# EAGLE design LB_BIT_w2_BRANCH-v02(rev1) (EAGLE 6.6.0)
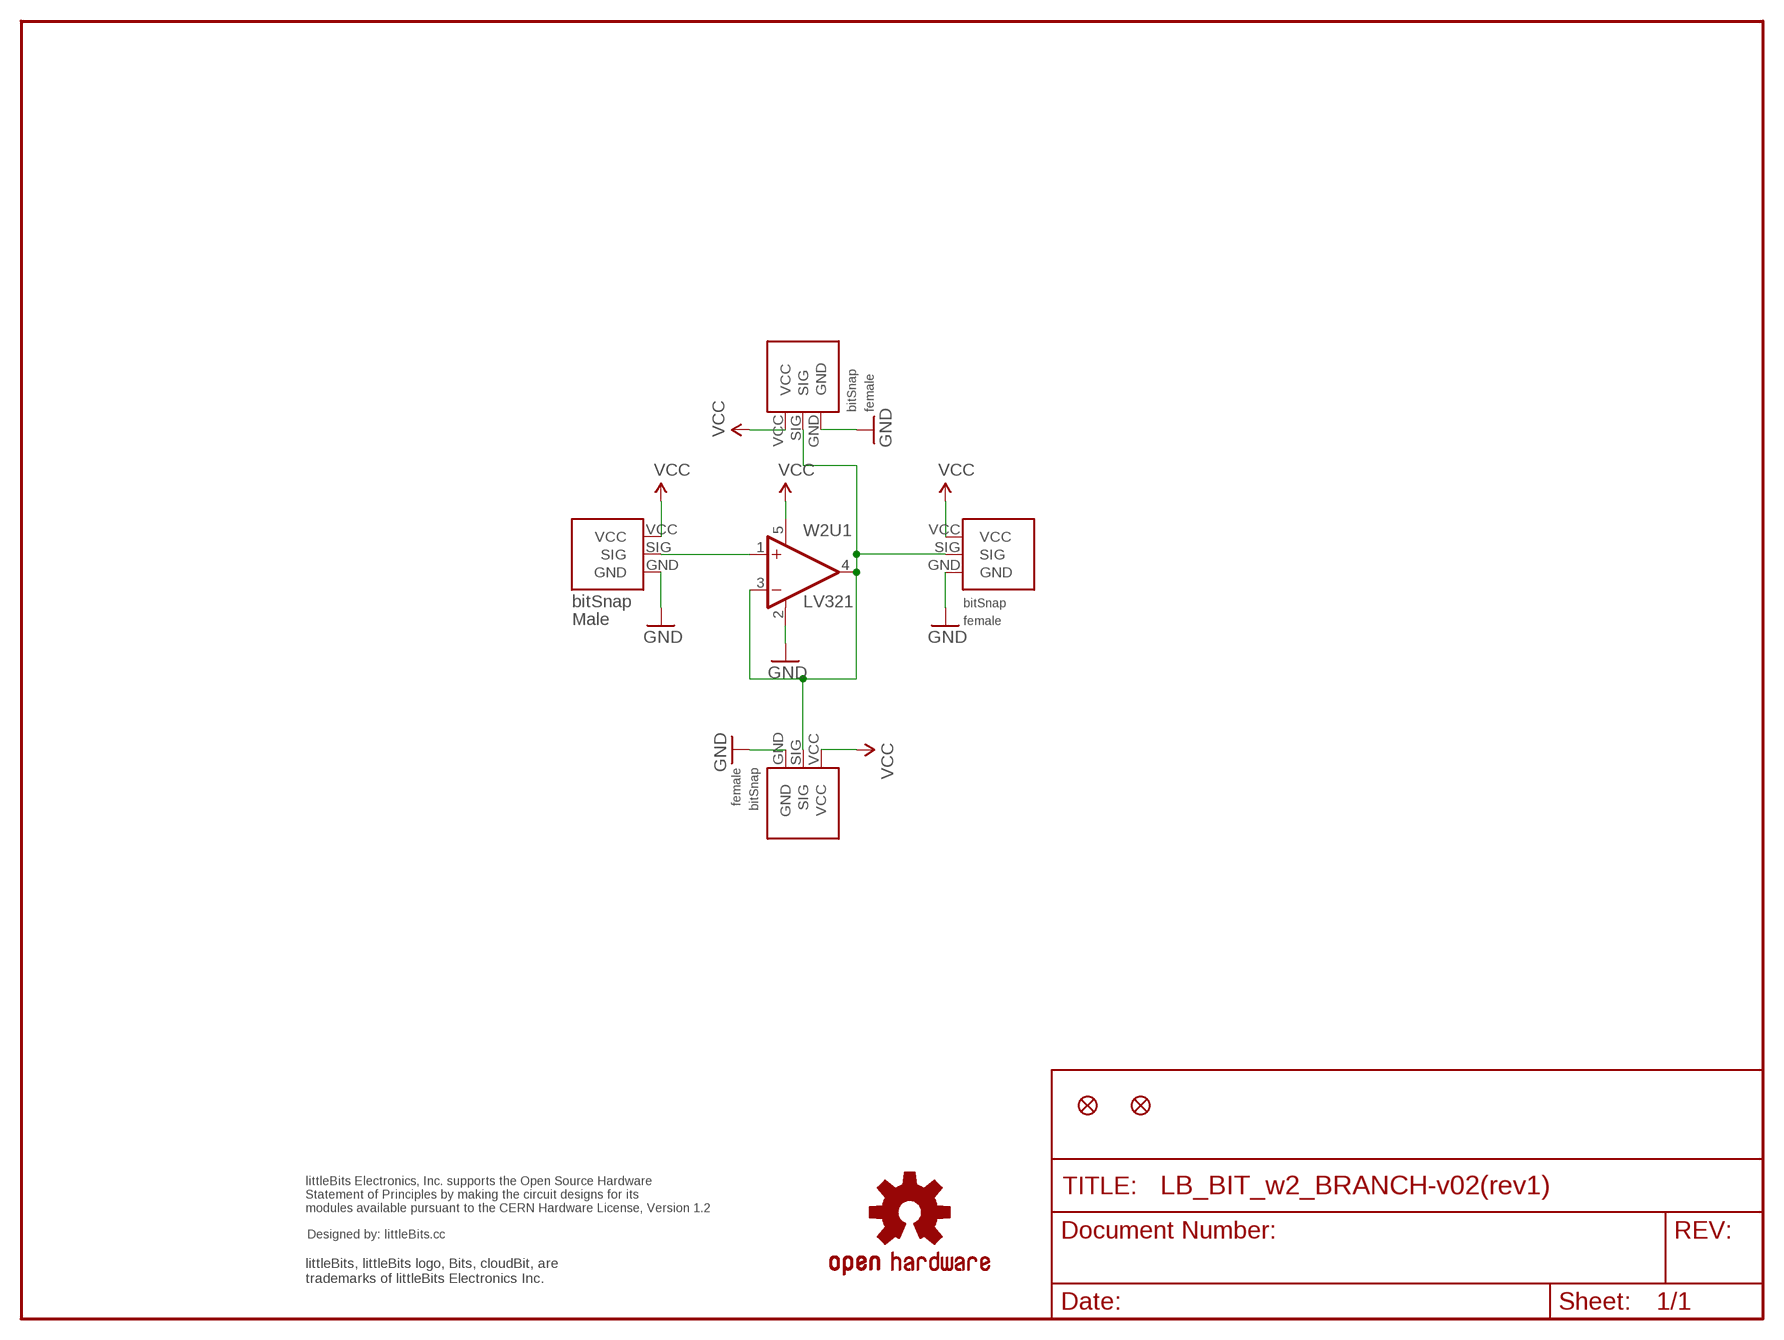
[diagram p0: schematic, sheet 1]

## Parts
JP1  FIDUCIAL1X2  [FIDUCIAL-1X2]
JP2  FIDUCIAL1X2  [FIDUCIAL-1X2]
U$1  OSHWCREDIT  [OSHWCREDIT]
U$6  OSHW-LOGOL  [OSHW-LOGO-L]
W2BSF1  BITSNAP_FEMALE  [BITSNAP_FEMALE]
W2BSF2  BITSNAP_FEMALE  [BITSNAP_FEMALE]
W2BSF3  BITSNAP_FEMALE  [BITSNAP_FEMALE]
W2BSM1  BITSNAP_MALE  [BITSNAP_MALE]
W2U1  LV321  [SC70-5]

## Nets
GND: W2BSF1.GND W2BSF2.GND W2BSF3.GND W2BSM1.GND W2U1.2(V-)
N$1: W2BSM1.SIG W2U1.1(+IN)
N$2: W2BSF1.SIG W2BSF2.SIG W2BSF3.SIG W2U1.3(-IN) W2U1.4(OUT)
VCC: W2BSF1.VCC W2BSF2.VCC W2BSF3.VCC W2BSM1.VCC W2U1.5(V+)

## Library data of the parts
JP1 JP2 = SparkFun:FIDUCIAL: Fiducial Alignment Points Various fiducial points for machine vision alignment.
U$1 = LITTLEBITS:OSHWCREDIT
U$6 = SparkFun_NEW:OSHW-LOGO: Open Source Hardware Logo This logo indicates the piece of hardware it is found on incorporates a OSHW license and/or adheres to the definition of open source hardware found here: http://freedomdefined.org/OSHW
W2BSF1-W2BSF3 = bitSnap:BITSNAP_FEMALE
W2BSM1 = bitSnap:BITSNAP_MALE
W2U1 = LITTLEBITS:LV321

## Board
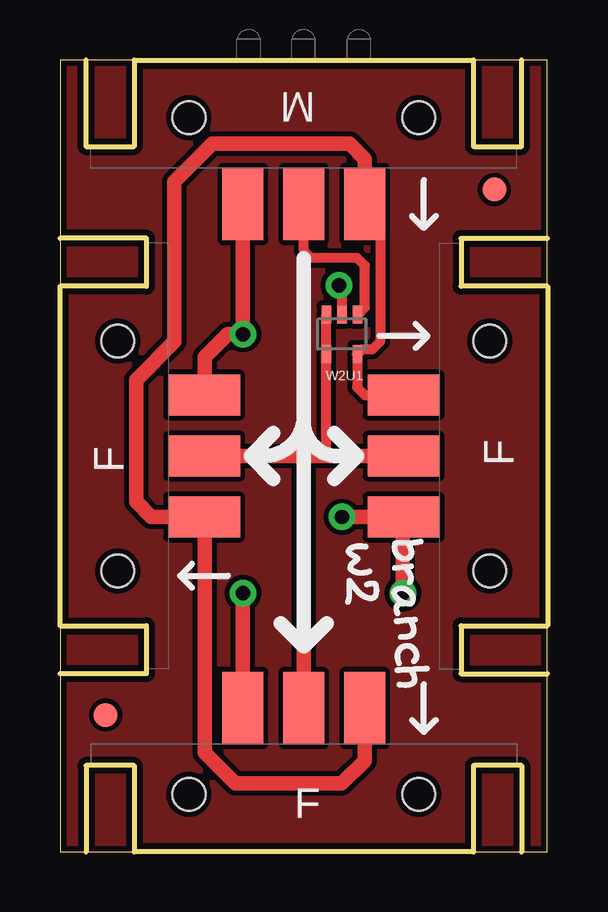
[diagram p1: board, top side]
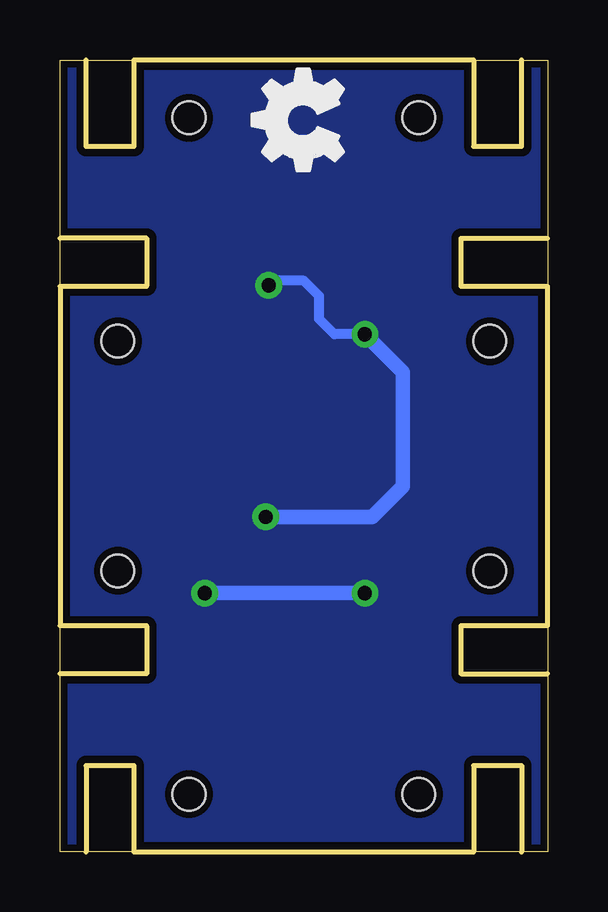
[diagram p2: board, bottom side, seen from below]

Size 20.32 x 33.02 mm. Coordinates in mm from the lower left corner, seen from the top.
Outline: 0,0 20.31,0 20.31,33.01 0,33.01 0,0
Copper layers (1*16): Top 0.035mm / dielectric 1.5mm / Bottom 0.035mm
Design rules "default": minimum track width 8mil, minimum drill 20mil, track to track 8mil, track to pad 8mil, pad to pad 8mil, via to via 8mil, smd to smd 8mil, copper to edge 10mil, drill to drill 8mil, minimum pad ring 12mil, minimum via ring 10mil, stop-mask expansion 4mil, vias tented up to drill 25mil, thermal gap 10mil

### Footprints (pad centres in the part's own frame; a part is rotated, then mirrored left to right if it is on the bottom)
FIDUCIAL-1X2 = smd 1 x 1: 1 0,0
BITSNAP_FEMALE = smd 1.7 x 3: GND 6.35,6; SIG 8.89,6; VCC 11.43,6 | hole 1.37: 13.68,2.41; 4.1,2.41
BITSNAP_MALE = smd 1.7 x 3: GND 11.43,6; SIG 8.89,6; VCC 6.35,6 | hole 1.37: 13.68,2.41; 4.1,2.41
SC70-5 = smd 0.4 x 0.75: 1 -0.65,-0.825; 2 0,-0.825; 3 0.65,-0.825; 4 0.65,0.825; 5 -0.65,0.825

### Placement (x,y rotation side)
JP1  1.91,5.71 0 top
JP2  18.1,27.62 0 top
U$1  -19.05,-22.86 0 top  (outside the outline)
U$5  [OSHW_FILLX150_NOTEXT]  8.51,27.56 0 top
U$6  -15.24,-10.16 0 top  (outside the outline)
U$13  [B]  13.63,13.23 270 top
U$14  [R]  13.64,12.27 270 top
U$15  [A]  13.56,11.13 270 top
U$16  [N]  13.87,9.83 270 top
U$17  [C]  13.79,8.84 270 top
U$18  [H]  13.72,7.77 270 top
U$19  [W]  11.89,13.03 270 top
U$20  [2]  11.73,11.58 270 top
W2BSF1  1.27,0 0 top
W2BSF2  20.32,7.62 90 top
W2BSF3  0,25.4 270 top
W2BSM1  19.05,33.02 180 top
W2U1  11.75,21.59 180 top

### Tracks (layer width: path | path; a pad name or v marks a point on that pad's centre or on a via)
GND  (via drill 0.6)
  Top 0.406: v11.62,23.62 11.75,23.5 W2U1.2
  Top 0.61: W2BSF3.GND 6.03,19.08 6.03,20.64 6.99,21.59 v7.62,21.59 W2BSM1.GND | W2BSF1.GND v7.62,10.79 | v14.29,10.79 14.29,13.94 W2BSF2.GND v11.75,13.97
  Bottom 0.406: v7.62,21.59 8.89,21.59 9.53,22.23 9.53,23.18 10.16,23.81 11.43,23.81 v11.62,23.62
  Bottom 0.61: v7.62,10.79 v14.29,10.79 | v11.75,13.97 7.3,13.97 6.03,15.24 6.03,20 v7.62,21.59
  pour Bottom (isolate 0.305): 0.32,32.7 20,32.7 20,0.32 0.32,0.32
N$1
  Top 0.406: W2BSM1.SIG 10.16,25.08 10.48,24.77 12.38,24.77 12.7,24.45 12.7,22.72 W2U1.1
N$2
  Top 0.406: 10.79,16.51 11.1,16.81 W2U1.4 W2U1.3
  Top 0.61: W2BSF3.SIG 8.26,16.51 9.21,16.51 10.16,16.51 | 10.16,16.51 10.79,16.51 W2BSF2.SIG | W2BSF1.SIG 10.16,16.5 10.16,16.51
N$3
  pour Top: 0.32,32.7 20,32.83 20,0.32 0.32,0.32
VCC
  Top 0.406: W2BSM1.VCC 13.34,26.39 13.34,21.27 13.02,20.95 12.59,20.95 W2U1.5 12.38,20.75 12.38,19.37 12.7,19.05 W2BSF2.VCC
  Top 0.61: W2BSM1.VCC 12.7,28.89 12.06,29.53 6.35,29.53 4.76,27.94 4.76,21.27 3.17,19.68 3.17,14.61 3.81,13.97 W2BSF3.VCC 6.03,13.94 6.03,4.13 7.3,2.86 11.75,2.86 12.7,3.81 W2BSF1.VCC